# Altium project Smart-Watch-Front.PrjPcb
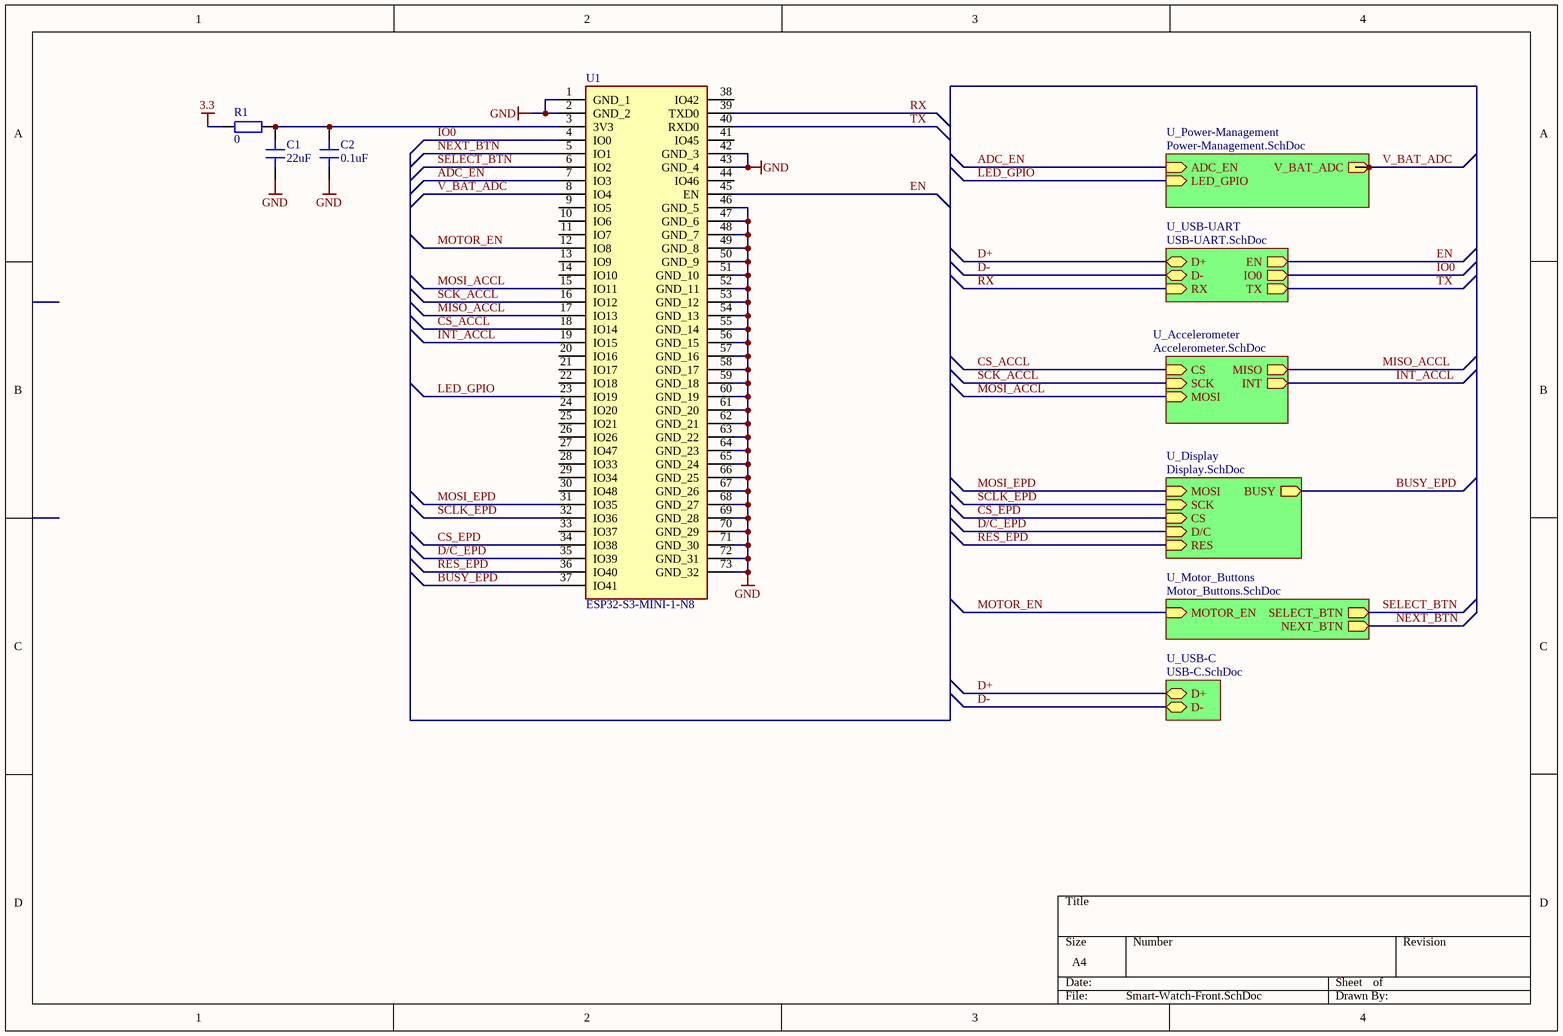
[diagram p0: Smart-Watch-Front.SchDoc]
7 sheets, 83 parts. Net scope: hierarchical (ports join the sheet entries above them; power ports are global).
Board file: SmartWatch.PcbDoc
Sheets:
  Smart-Watch-Front.SchDoc
    U_Accelerometer = Accelerometer.SchDoc
    U_USB-UART = USB-UART.SchDoc
    U_USB-C = USB-C.SchDoc
    U_Display = Display.SchDoc
    U_Motor_Buttons = Motor_Buttons.SchDoc
    U_Power-Management = Power-Management.SchDoc

## Sheet Smart-Watch-Front.SchDoc
size A4; SheetNumber: 1; SheetTotal: 7

### Parts
C1  22uF  [0603_CAP]
C2  0.1uF  [0603_CAP]
R1  0  [0603]
U1  ESP32-S3-MINI-1-N8  [ESP32S3MINI1N8]

### Sub-sheets
U_Accelerometer = Accelerometer.SchDoc: CS (in), SCK (in), MISO (out), MOSI (in), INT (out)
U_Display = Display.SchDoc: MOSI (in), SCK (in), CS (in), D/C (in), RES (in), BUSY (out)
U_Motor_Buttons = Motor_Buttons.SchDoc: MOTOR_EN (in), SELECT_BTN (out), NEXT_BTN (out)
U_Power-Management = Power-Management.SchDoc: V_BAT_ADC (out), ADC_EN (in), LED_GPIO (in)
U_USB-C = USB-C.SchDoc: D+ (bidir), D- (bidir)
U_USB-UART = USB-UART.SchDoc: D+ (bidir), D- (bidir), RX (in), EN (out), IO0 (out), TX (out)

### Nets
3.3: R1.1
GND: C1.1 C2.1 U1.1(GND_1) U1.2(GND_2) U1.42(GND_3) U1.43(GND_4) U1.46(GND_5) U1.47(GND_6) U1.48(GND_7) U1.49(GND_8) U1.50(GND_9) U1.51(GND_10) U1.52(GND_11) U1.53(GND_12) U1.54(GND_13) U1.55(GND_14) U1.56(GND_15) U1.57(GND_16) U1.58(GND_17) U1.59(GND_18) U1.60(GND_19) U1.61(GND_20) U1.62(GND_21) U1.63(GND_22) U1.64(GND_23) U1.65(GND_24) U1.66(GND_25) U1.67(GND_26) U1.68(GND_27) U1.69(GND_28) U1.70(GND_29) U1.71(GND_30) U1.72(GND_31) U1.73(GND_32)
ADC_EN: U1.7(IO3) ; sheet U_Power-Management/ADC_EN
BUSY_EPD: U1.37(IO41) ; sheet U_Display/BUSY
CS_ACCL: U1.18(IO14) ; sheet U_Accelerometer/CS
CS_EPD: U1.34(IO38) ; sheet U_Display/CS
D+: sheet U_USB-UART/D+, sheet U_USB-C/D+
D-: sheet U_USB-UART/D-, sheet U_USB-C/D-
D/C_EPD: U1.35(IO39) ; sheet U_Display/D/C
EN: U1.45(EN) ; sheet U_USB-UART/EN
INT_ACCL: U1.19(IO15) ; sheet U_Accelerometer/INT
IO0: U1.4(IO0) ; sheet U_USB-UART/IO0
LED_GPIO: U1.23(IO19) ; sheet U_Power-Management/LED_GPIO
MISO_ACCL: U1.17(IO13) ; sheet U_Accelerometer/MISO
MOSI_ACCL: U1.15(IO11) ; sheet U_Accelerometer/MOSI
MOSI_EPD: U1.31(IO35) ; sheet U_Display/MOSI
MOTOR_EN: U1.12(IO8) ; sheet U_Motor_Buttons/MOTOR_EN
NEXT_BTN: U1.5(IO1) ; sheet U_Motor_Buttons/NEXT_BTN
RES_EPD: U1.36(IO40) ; sheet U_Display/RES
RX: U1.39(TXD0) ; sheet U_USB-UART/RX
SCK_ACCL: U1.16(IO12) ; sheet U_Accelerometer/SCK
SCLK_EPD: U1.32(IO36) ; sheet U_Display/SCK
SELECT_BTN: U1.6(IO2) ; sheet U_Motor_Buttons/SELECT_BTN
TX: U1.40(RXD0) ; sheet U_USB-UART/TX
V_BAT_ADC: U1.8(IO4) ; sheet U_Power-Management/V_BAT_ADC
NetC1_2: C1.2 C2.2 R1.2 U1.3(3V3)

Not connected (* = marked no-connect by the designer): U1 9(IO5) 10(IO6) 11(IO7) 13(IO9) 14(IO10) 20(IO16) 21(IO17) 22(IO18) 24(IO20) 25(IO21) 26(IO26) 27(IO47) 28(IO33) 29(IO34) 30(IO48) 33(IO37) 38(IO42) 41(IO45) 44(IO46)

### Library data of the parts
C1 C2 = C
R1 = R
U1 = ESP32-S3-MINI-1-N8: Integrated Circuit; Manufacturer_Name: Espressif Systems; Datasheet Link: https://www.espressif.com/sites/default/files/documentation/esp32-s3-mini-1_mini-1u_datasheet_en.pdf; Height: 2.55mm; Manufacturer_Part_Number: ESP32-S3-MINI-1-N8; Mouser Part Number: 356-ESP32-S3-MINI1N8; Mouser Price/Stock: https://www.mouser.co.uk/ProductDetail/Espressif-Systems/ESP32-S3-MINI-1-N8?qs=XAiT9M5g4x82rl6F%2FIYUQg%3D%3D

## Sheet Accelerometer.SchDoc
size A4; SheetNumber: 3; SheetTotal: 7
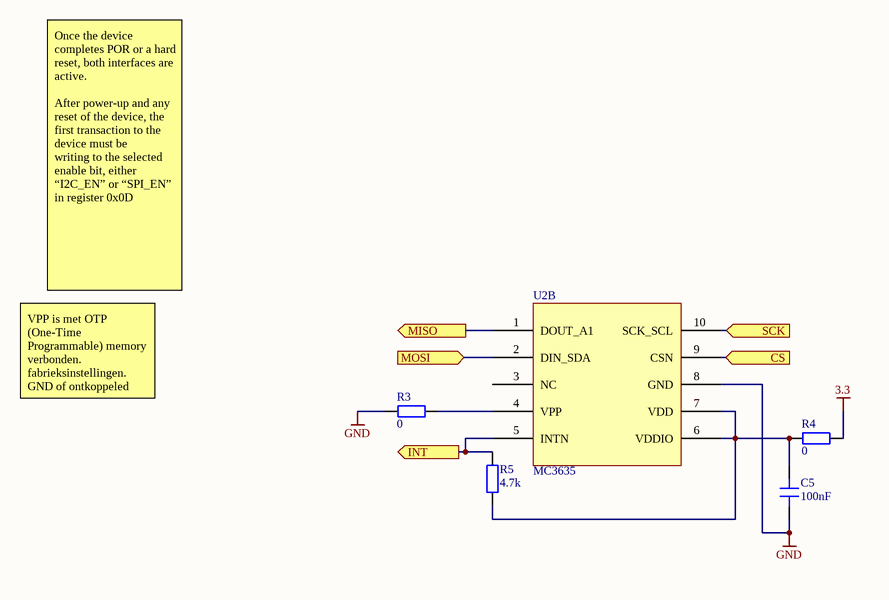
[diagram p1: Accelerometer.SchDoc]

### Parts
C5  100nF  [0603_CAP]
R3  0  [0603]
R4  0  [0603]
R5  4.7k  [0402_RES]
U2  MC3635  [MC3635]  (part B of 2)

### Ports
CS (in, see Smart-Watch-Front[3B]), INT (out, see Smart-Watch-Front[4B]), MISO (out, see Smart-Watch-Front[4B]), MOSI (in, see Smart-Watch-Front[3B]), SCK (in, see Smart-Watch-Front[3B])

### Nets
3.3: R4.1
GND: C5.1 R3.2 U2.8(GND)
CS_ACCL: U2.9(CSN) ; port CS
INT_ACCL: R5.2 U2.5(INTN) ; port INT
MISO_ACCL: U2.1(DOUT_A1) ; port MISO
MOSI_ACCL: U2.2(DIN_SDA) ; port MOSI
SCK_ACCL: U2.10(SCK_SCL) ; port SCK
NetC5_2: C5.2 R4.2 R5.1 U2.6(VDDIO) U2.7(VDD)
NetR3_1: R3.1 U2.4(VPP)

Not connected (* = marked no-connect by the designer): U2 3(NC)

### Notes on the sheet
- Once the device completes POR or a hard reset, both interfaces are active.
  After power-up and any reset of the device, the first transaction to the device must be
  writing to the selected enable bit, either “I2C_EN” or “SPI_EN” in register 0x0D
- VPP is met OTP (One-Time Programmable) memory verbonden.
  fabrieksinstellingen.
  GND of ontkoppeled

### Library data of the parts
C5 = C
R3-R5 = R

## Sheet USB-UART.SchDoc
size A4; SheetNumber: 6; SheetTotal: 7
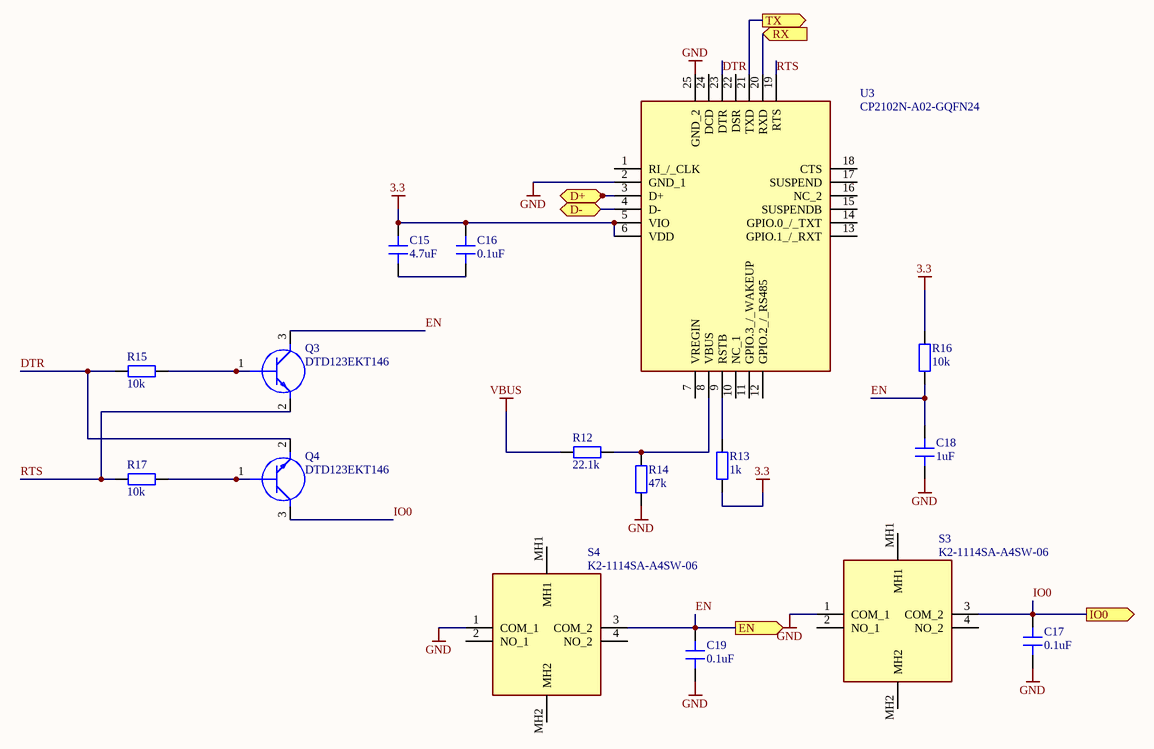
[diagram p2: USB-UART.SchDoc]

### Parts
C15  4.7uF  [0603_CAP]
C16  0.1uF  [0603_CAP]
C17  0.1uF  [0603_CAP]
C18  1uF  [0603_CAP]
C19  0.1uF  [0603_CAP]
Q3  DTD123EKT146  [FP-SS8050-G-IPC_A]
Q4  DTD123EKT146  [FP-SS8050-G-IPC_A]
R12  22.1k  [0402_RES]
R13  1k  [0402_RES]
R14  47k  [0402_RES]
R15  10k  [0402_RES]
R16  10k  [0402_RES]
R17  10k  [0402_RES]
S3  K2-1114SA-A4SW-06  [K21114SAA4SW06]
S4  K2-1114SA-A4SW-06  [K21114SAA4SW06]
U3  CP2102N-A02-GQFN24  [FP-CP2102N-A02-GQFN24-MFG]

### Ports
D+ (bidir, see Smart-Watch-Front[3B], USB-C[2C]), D- (bidir, see Smart-Watch-Front[3B], USB-C[2C]), EN (out, see Smart-Watch-Front[4B]), IO0 (out, see Smart-Watch-Front[4B]), RX (in, see Smart-Watch-Front[3B]), TX (out, see Smart-Watch-Front[4B])

### Nets
3.3: C15.1 C16.1 R13.2 R16.1 U3.5(VIO) U3.6(VDD)
GND: C17.2 C18.1 C19.2 R14.2 S3.1(COM_1) S4.1(COM_1) U3.2(GND_1) U3.25(GND_2)
VBUS: R12.2
D+: U3.3(D+) ; port D+
D-: U3.4(D-) ; port D-
DTR: Q4.2(E) R15.1 U3.23(DTR)
EN: C18.2 C19.1 Q3.3(C) R16.2 S4.3(COM_2) ; port EN
IO0: C17.1 Q4.3(C) S3.3(COM_2) ; port IO0
RTS: Q3.2(E) R17.1 U3.19(RTS)
RX: U3.20(RXD) ; port RX
TX: U3.21(TXD) ; port TX
NetC15_2: C15.2 C16.2
NetQ3_1: Q3.1(B) R15.2
NetQ4_1: Q4.1(B) R17.2
NetR12_1: R12.1 R14.1 U3.8(VBUS)
NetR13_1: R13.1 U3.9(RSTB)

Not connected (* = marked no-connect by the designer): S3 2(NO_1) 4(NO_2) MH1 MH2; S4 2(NO_1) 4(NO_2) MH1 MH2; U3 1(RI_/_CLK) 7(VREGIN) 10(NC_1) 11(GPIO.3_/_WAKEUP) 12(GPIO.2_/_RS485) 13(GPIO.1_/_RXT) 14(GPIO.0_/_TXT) 15(SUSPENDB) 16(NC_2) 17(SUSPEND) 18(CTS) 22(DSR) 24(DCD)

### Library data of the parts
C15-C19 = C
Q3 Q4 = DTD123EKT146: Transistor BJT NPN; Manufacturer_Name: ROHM Semiconductor; Datasheet Link: http://rohmfs.rohm.com/en/products/databook/datasheet/discrete/transistor/digital/dtd123ekt146-e.pdf; Height: 1.3mm; Manufacturer_Part_Number: DTD123EKT146; Mouser Part Number: 755-DTD123EKT146; Mouser Price/Stock: https://www.mouser.com/Search/Refine.aspx?Keyword=755-DTD123EKT146
R12-R17 = R
S3 S4 = K2-1114SA-A4SW-06: Switch; Manufacturer_Name: Korean Hroparts Elec; Datasheet Link: https://datasheet.lcsc.com/szlcsc/Korean-Hroparts-Elec-K2-1114SA-A4SW-06_C136662.pdf; Height: 1.65mm; Manufacturer_Part_Number: K2-1114SA-A4SW-06
U3 = CP2102N-A02-GQFN24: Integrated Circuit; Manufacturer_Name: Silicon Labs; Datasheet Link: https://componentsearchengine.com/Datasheets/1/CP2102N-A02-GQFN24.pdf; Height: 0.8mm; Manufacturer_Part_Number: CP2102N-A02-GQFN24; Mouser Part Number: 634-CP2102NA02GQFN24; Mouser Price/Stock: https://www.mouser.co.uk/ProductDetail/Silicon-Labs/CP2102N-A02-GQFN24?qs=u16ybLDytRYKabtL%2FE7DZA%3D%3D; Arrow Part Number: CP2102N-A02-GQFN24; Arrow Price/Stock: https://www.arrow.com/en/products/cp2102n-a02-gqfn24/silicon-labs?utm_currency=USD&region=europe

## Sheet USB-C.SchDoc
size A4; SheetNumber: 5; SheetTotal: 7
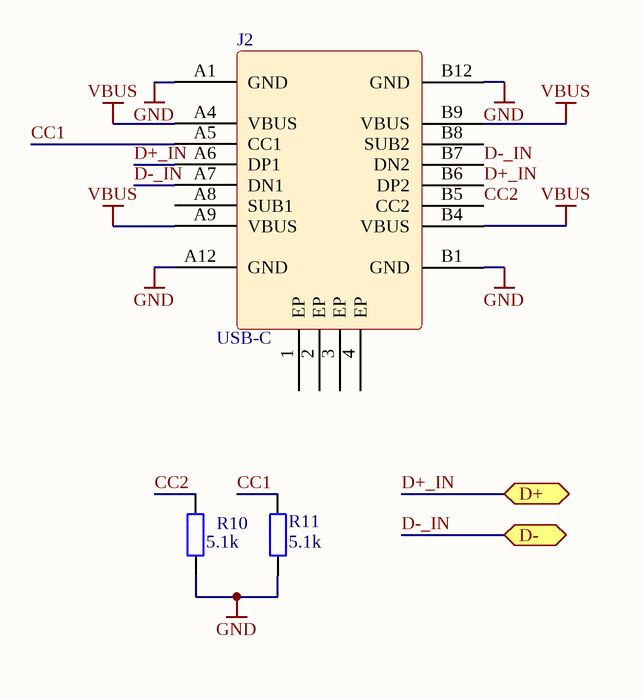
[diagram p3: USB-C.SchDoc]

### Parts
J2  USB-C  [USB-C_1]
R10  5.1k  [0402_RES]
R11  5.1k  [0402_RES]

### Ports
D+ (bidir, see Smart-Watch-Front[3C], USB-UART[2A]), D- (bidir, see Smart-Watch-Front[3C], USB-UART[2A])

### Nets
GND: J2.A1(GND) J2.A12(GND) J2.B1(GND) J2.B12(GND) R10.1 R11.1
VBUS: J2.A4(VBUS) J2.A9(VBUS) J2.B4(VBUS) J2.B9(VBUS)
CC1: J2.A5(CC1) R11.2
CC2: J2.B5(CC2) R10.2
D+_IN: J2.A6(DP1) J2.B6(DP2) ; port D+  [project net D+]
D-_IN: J2.A7(DN1) J2.B7(DN2) ; port D-  [project net D-]

Not connected (* = marked no-connect by the designer): J2 1(EP) 2(EP) 3(EP) 4(EP) A8(SUB1) B8(SUB2)

### Library data of the parts
J2 = USB-C_1
R10 R11 = R

## Sheet Display.SchDoc
size A4; SheetNumber: 4; SheetTotal: 7
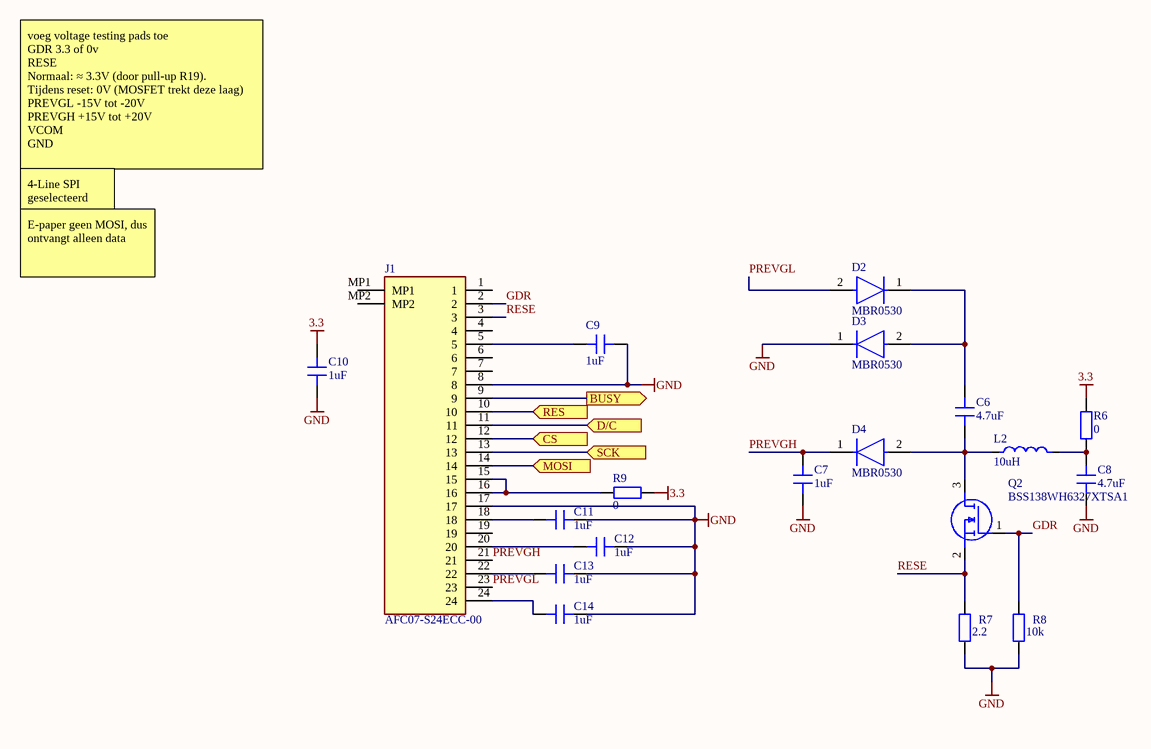
[diagram p4: Display.SchDoc]

### Parts
C6  4.7uF  [0603_CAP]
C7  1uF  [0603_CAP]
C8  4.7uF  [0603_CAP]
C9  1uF  [0603_CAP]
C10  1uF  [0603_CAP]
C11  1uF  [0603_CAP]
C12  1uF  [0603_CAP]
C13  1uF  [0603_CAP]
C14  1uF  [0603_CAP]
D2  MBR0530  [SOD3716X135N]
D3  MBR0530  [SOD3716X135N]
D4  MBR0530  [SOD3716X135N]
J1  AFC07-S24ECC-00  [AFC07S24ECC00]
L2  10uH  [NRS5040T3R3NMGJV]
Q2  BSS138WH6327XTSA1  [SOT65P210X110-3N]
R6  0  [0603]
R7  2.2  [0402_RES]
R8  10k  [0402_RES]
R9  0  [0603]

### Ports
BUSY (out, see Smart-Watch-Front[4B]), CS (in, see Smart-Watch-Front[3C]), D/C (in, see Smart-Watch-Front[3C]), MOSI (in, see Smart-Watch-Front[3B]), RES (in, see Smart-Watch-Front[3C]), SCK (in, see Smart-Watch-Front[3B])

### Nets
3.3: C10.2 R6.1 R9.1
GND: C7.1 C8.1 C9.1 C10.1 C11.2 C12.2 C13.2 C14.2 D3.1(C) J1.8 J1.17 R7.1 R8.2
BUSY_EPD: J1.9 ; port BUSY
CS_EPD: J1.12 ; port CS
D/C_EPD: J1.11 ; port D/C
GDR: J1.2 Q2.1(G) R8.1
MOSI_EPD: J1.14 ; port MOSI
PREVGH: C7.2 D4.1(C) J1.21
PREVGL: D2.2(A) J1.23
RES_EPD: J1.10 ; port RES
RESE: J1.3 Q2.2(S) R7.2
SCLK_EPD: J1.13 ; port SCK
NetC6_1: C6.1 D4.2(A) L2.1 Q2.3(D)
NetC6_2: C6.2 D2.1(C) D3.2(A)
NetC8_2: C8.2 L2.2 R6.2
NetC9_2: C9.2 J1.5
NetC11_1: C11.1 J1.18
NetC12_1: C12.1 J1.20
NetC13_1: C13.1 J1.22
NetC14_1: C14.1 J1.24
NetJ1_15: J1.15 J1.16 R9.2

Not connected (* = marked no-connect by the designer): J1 1 4 6 7 19 MP1 MP2

### Notes on the sheet
- voeg voltage testing pads toe
  GDR 3.3 of 0v
  RESE
  Normaal: ≈ 3.3V (door pull-up R19).
  Tijdens reset: 0V (MOSFET trekt deze laag)
  PREVGL -15V tot -20V
  PREVGH +15V tot +20V
  VCOM
  GND
  in datsheet ic: SSD1681
- 4-Line SPI geselecteerd met pin 8 GND
- E-paper geen MOSI, dus ontvangt alleen data

### Library data of the parts
C6-C14 = C
D2-D4 = CMP-00030-46456310-1: 1N4148W-G3-08 Rectifier Diode, 1 Phase, 1 Element, 0.15A, 100V V(RRM), Silicon; Forward Current: 150mA; Reverse Recovery Time: 4ns; Peak Non-Repetitive Surge Current: 500mA; Element Configuration: Single; Forward Voltage: 1.2V; Max Reverse Voltage (DC): 75V; Schedule B: 8541100070, 8541100070|8541100070|8541100070|8541100070|8541100070; Max Repetitive Reverse Voltage (Vrrm): 100V; Weight: 9.412042mg; NexarPartId: 46456310; Contact Plating: Tin; Max Operating Temperature: 150°C; Case/Package: SOD; Mount: Surface Mount; RoHS: Compliant; Min Operating Temperature: -55°C; Average Rectified Current: 150mA; Number of Pins: 2
J1 = AFC07-S24ECC-00: Connector; Manufacturer_Name: JUSHUO; Datasheet Link: https://datasheet.lcsc.com/szlcsc/1811021340_JUSHUO-AFC07-S24ECC-00_C11092.pdf; Height: 2mm; Manufacturer_Part_Number: AFC07-S24ECC-00
L2 = coil
Q2 = BSS138WH6327XTSA1: MOSFET (N-Channel); Manufacturer_Name: Infineon; Datasheet Link: https://www.infineon.com/dgdl/Infineon-BSS138W-DS-v02_43-en.pdf?fileId=db3a304335113a6301351e62fcb4131f; Height: 1mm; Manufacturer_Part_Number: BSS138WH6327XTSA1; Mouser Part Number: 726-BSS138WH6327XTSA; Mouser Price/Stock: https://www.mouser.co.uk/ProductDetail/Infineon-Technologies/BSS138WH6327XTSA1?qs=Dj8dEyEphkMUJZog1oMAlA%3D%3D; Arrow Part Number: BSS138WH6327XTSA1; Arrow Price/Stock: https://www.arrow.com/en/products/bss138wh6327xtsa1/infineon-technologies-ag?utm_currency=USD&region=europe
R6-R9 = R

## Sheet Motor_Buttons.SchDoc
size A4; SheetNumber: 2; SheetTotal: 7
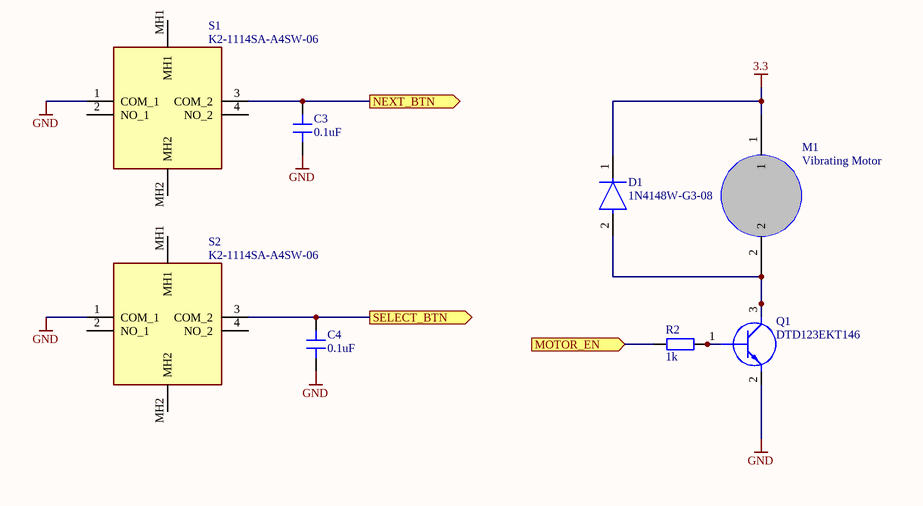
[diagram p5: Motor_Buttons.SchDoc]

### Parts
C3  0.1uF  [0603_CAP]
C4  0.1uF  [0603_CAP]
D1  1N4148W-G3-08  [SOD3716X135N]
M1  Vibrating Motor  [Motor]
Q1  DTD123EKT146  [FP-SS8050-G-IPC_A]
R2  1k  [0402_RES]
S1  K2-1114SA-A4SW-06  [K21114SAA4SW06]
S2  K2-1114SA-A4SW-06  [K21114SAA4SW06]

### Ports
MOTOR_EN (in, see Smart-Watch-Front[3C]), NEXT_BTN (out, see Smart-Watch-Front[4C]), SELECT_BTN (out, see Smart-Watch-Front[4C])

### Nets
3.3: D1.1(C) M1.1
GND: C3.2 C4.2 Q1.2(E) S1.1(COM_1) S2.1(COM_1)
MOTOR_EN: R2.1 ; port MOTOR_EN
NEXT_BTN: C3.1 S1.3(COM_2) ; port NEXT_BTN
SELECT_BTN: C4.1 S2.3(COM_2) ; port SELECT_BTN
NetD1_2: D1.2(A) M1.2 Q1.3(C)
NetQ1_1: Q1.1(B) R2.2

Not connected (* = marked no-connect by the designer): S1 2(NO_1) 4(NO_2) MH1 MH2; S2 2(NO_1) 4(NO_2) MH1 MH2

### Library data of the parts
C3 C4 = C
D1 = CMP-00030-46456310-1: as D2 on sheet Display; Schedule B: 8541100070, 8541100070|8541100070|8541100070|8541100070|8541100070; Max Repetitive Reverse Voltage (Vrrm): 100V; Weight: 9.412042mg; NexarPartId: 46456310; Contact Plating: Tin; Max Operating Temperature: 150°C; Case/Package: SOD; Mount: Surface Mount; RoHS: Compliant; Min Operating Temperature: -55°C; Average Rectified Current: 150mA; Number of Pins: 2
M1 = Component_1
Q1 = DTD123EKT146: as Q3 on sheet USB-UART; Datasheet Link: http://rohmfs.rohm.com/en/products/databook/datasheet/discrete/transistor/digital/dtd123ekt146-e.pdf; Height: 1.3mm; Manufacturer_Part_Number: DTD123EKT146; Mouser Part Number: 755-DTD123EKT146; Mouser Price/Stock: https://www.mouser.com/Search/Refine.aspx?Keyword=755-DTD123EKT146
R2 = R
S1 S2 = K2-1114SA-A4SW-06: as S3 on sheet USB-UART; Datasheet Link: https://datasheet.lcsc.com/szlcsc/Korean-Hroparts-Elec-K2-1114SA-A4SW-06_C136662.pdf; Height: 1.65mm; Manufacturer_Part_Number: K2-1114SA-A4SW-06

## Sheet Power-Management.SchDoc
size A4; SheetNumber: 7; SheetTotal: 7
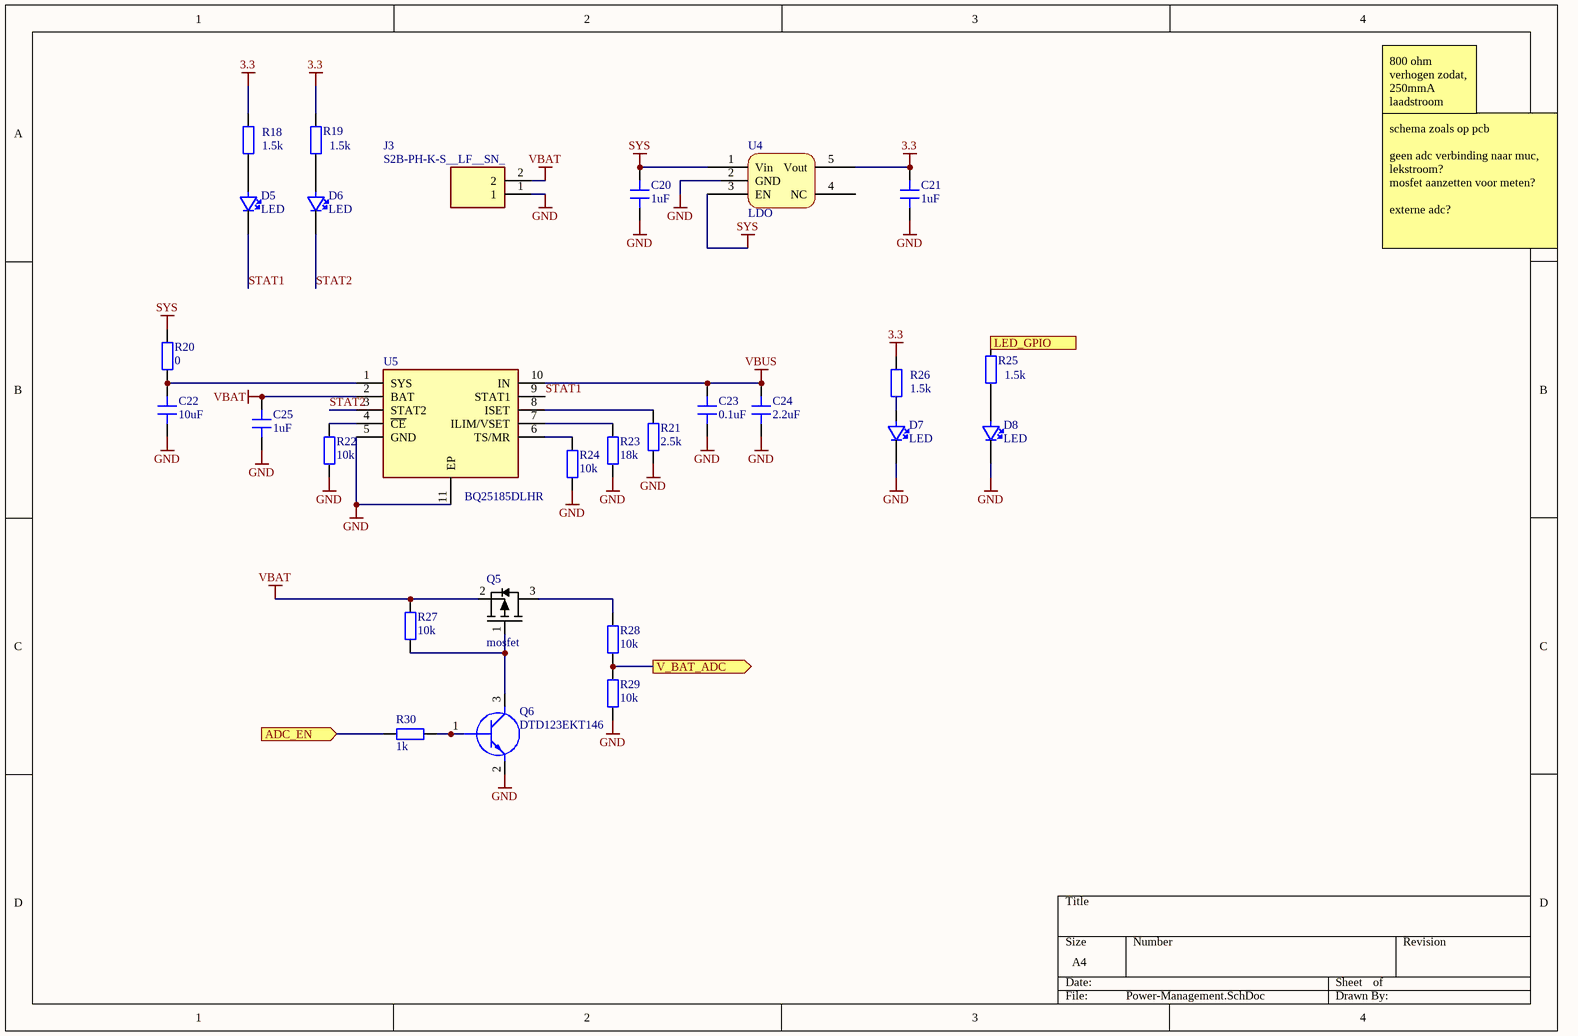
[diagram p6: Power-Management.SchDoc]

### Parts
C20  1uF  [0603_CAP]
C21  1uF  [0603_CAP]
C22  10uF  [0603_CAP]
C23  0.1uF  [0603_CAP]
C24  2.2uF  [0603_CAP]
C25  1uF  [0603_CAP]
D5  LED  [0402_LED]
D6  LED  [0402_LED]
D7  LED  [0402_LED]
D8  LED  [0402_LED]
J3  S2B-PH-K-S__LF__SN_  [S2BPHKSLFSN]
Q5  mosfet  [SOT95P230X110-3N]
Q6  DTD123EKT146  [FP-SS8050-G-IPC_A]
R18  1.5k  [0402_RES]
R19  1.5k  [0402_RES]
R20  0  [0603]
R21  2.5k  [0402_RES]
R22  10k  [0402_RES]
R23  18k  [0402_RES]
R24  10k  [0402_RES]
R25  1.5k  [0402_RES]
R26  1.5k  [0402_RES]
R27  10k  [0402_RES]
R28  10k  [0402_RES]
R29  10k  [0402_RES]
R30  1k  [0402_RES]
U4  LDO  [LDO]
U5  BQ25185DLHR  [SON40P220X200X80-11N]

### Ports
ADC_EN (in, see Smart-Watch-Front[3A]), LED_GPIO (in, see Smart-Watch-Front[3A]), V_BAT_ADC (out, see Smart-Watch-Front[4A])

### Nets
3.3: C21.2 R18.2 R19.2 R26.2 U4.5(Vout)
GND: C20.1 C21.1 C22.1 C23.1 C24.1 C25.1 D7.2(+) D8.2(+) J3.1 Q6.2(E) R21.1 R22.1 R23.1 R24.1 R29.1 U4.2(GND) U5.5(GND) U5.11(EP)
SYS: C20.2 R20.2 U4.1(Vin) U4.3(EN)
VBAT: C25.2 J3.2 Q5.2 R27.2 U5.2(BAT)
VBUS: C23.2 C24.2 U5.10(IN)
ADC_EN: R30.2 ; port ADC_EN
LED_GPIO: R25.2 ; port LED_GPIO
STAT1: D5.2(+) U5.9(STAT1)
STAT2: D6.2(+) U5.3(STAT2)
V_BAT_ADC: R28.1 R29.2 ; port V_BAT_ADC
NetC22_2: C22.2 R20.1 U5.1(SYS)
NetD5_1: D5.1 R18.1
NetD6_1: D6.1 R19.1
NetD7_1: D7.1 R26.1
NetD8_1: D8.1 R25.1
NetQ5_1: Q5.1 Q6.3(C) R27.1
NetQ5_3: Q5.3 R28.2
NetQ6_1: Q6.1(B) R30.1
NetR21_2: R21.2 U5.8(ISET)
NetR22_2: R22.2 U5.4(~{CE})
NetR23_2: R23.2 U5.7(ILIM/VSET)
NetR24_2: R24.2 U5.6(TS/MR)

Not connected (* = marked no-connect by the designer): U4 4(NC)

### Notes on the sheet
- 800 ohm verhogen zodat, 250mmA laadstroom
- schema zoals op pcb
  geen adc verbinding naar muc, lekstroom?
  mosfet aanzetten voor meten?
  externe adc?

### Library data of the parts
C20-C25 = C
J3 = S2B-PH-K-S__LF__SN_: Connector; Manufacturer_Name: JST (JAPAN SOLDERLESS TERMINALS); Manufacturer_Part_Number: S2B-PH-K-S (LF)(SN); Datasheet Link: http://www.jst-mfg.com/product/pdf/eng/ePH.pdf; Height: 4.8mm
Q6 = DTD123EKT146: as Q3 on sheet USB-UART; Datasheet Link: http://rohmfs.rohm.com/en/products/databook/datasheet/discrete/transistor/digital/dtd123ekt146-e.pdf; Height: 1.3mm; Manufacturer_Part_Number: DTD123EKT146; Mouser Part Number: 755-DTD123EKT146; Mouser Price/Stock: https://www.mouser.com/Search/Refine.aspx?Keyword=755-DTD123EKT146
R18-R23 R25-R30 = R
R24 = R: NTC thermistor
U5 = BQ25185DLHR: Integrated Circuit; Manufacturer_Name: Texas Instruments; Datasheet Link: https://www.ti.com/lit/ds/symlink/bq25185.pdf?ts=1706857561339&ref_url=https%253A%252F%252Fwww.ti.com%252Fproduct%252FBQ25185; Height: 0.8mm; Manufacturer_Part_Number: BQ25185DLHR; Mouser Part Number: 595-BQ25185DLHR; Mouser Price/Stock: https://www.mouser.co.uk/ProductDetail/Texas-Instruments/BQ25185DLHR?qs=Z%252BL2brAPG1IbO%2FV3RqsaPw%3D%3D

## Nets that join several sheets
3.3: Smart-Watch-Front (R1.1), Accelerometer (R4.1), USB-UART (6 pins), Display (C10.2 R6.1 R9.1), Motor_Buttons (D1.1 M1.1), Power-Management (5 pins)
GND: Smart-Watch-Front (34 pins), Accelerometer (C5.1 R3.2 U2.8), USB-UART (8 pins), USB-C (6 pins), Display (13 pins), Motor_Buttons (5 pins), Power-Management (18 pins)
VBUS: USB-UART (R12.2), USB-C (J2.A4 J2.A9 J2.B4 J2.B9), Power-Management (C23.2 C24.2 U5.10)
ADC_EN: Smart-Watch-Front (U1.7), Power-Management (R30.2)
BUSY_EPD: Smart-Watch-Front (U1.37), Display (J1.9)
CS_ACCL: Smart-Watch-Front (U1.18), Accelerometer (U2.9)
CS_EPD: Smart-Watch-Front (U1.34), Display (J1.12)
D+: USB-UART (U3.3), USB-C (J2.A6 J2.B6)
D-: USB-UART (U3.4), USB-C (J2.A7 J2.B7)
D/C_EPD: Smart-Watch-Front (U1.35), Display (J1.11)
EN: Smart-Watch-Front (U1.45), USB-UART (5 pins)
INT_ACCL: Smart-Watch-Front (U1.19), Accelerometer (R5.2 U2.5)
IO0: Smart-Watch-Front (U1.4), USB-UART (C17.1 Q4.3 S3.3)
LED_GPIO: Smart-Watch-Front (U1.23), Power-Management (R25.2)
MISO_ACCL: Smart-Watch-Front (U1.17), Accelerometer (U2.1)
MOSI_ACCL: Smart-Watch-Front (U1.15), Accelerometer (U2.2)
MOSI_EPD: Smart-Watch-Front (U1.31), Display (J1.14)
MOTOR_EN: Smart-Watch-Front (U1.12), Motor_Buttons (R2.1)
NEXT_BTN: Smart-Watch-Front (U1.5), Motor_Buttons (C3.1 S1.3)
RES_EPD: Smart-Watch-Front (U1.36), Display (J1.10)
RX: Smart-Watch-Front (U1.39), USB-UART (U3.20)
SCK_ACCL: Smart-Watch-Front (U1.16), Accelerometer (U2.10)
SCLK_EPD: Smart-Watch-Front (U1.32), Display (J1.13)
SELECT_BTN: Smart-Watch-Front (U1.6), Motor_Buttons (C4.1 S2.3)
TX: Smart-Watch-Front (U1.40), USB-UART (U3.21)
V_BAT_ADC: Smart-Watch-Front (U1.8), Power-Management (R28.1 R29.2)